# EAGLE design bluino_one_2.0 (EAGLE 7.6.0)
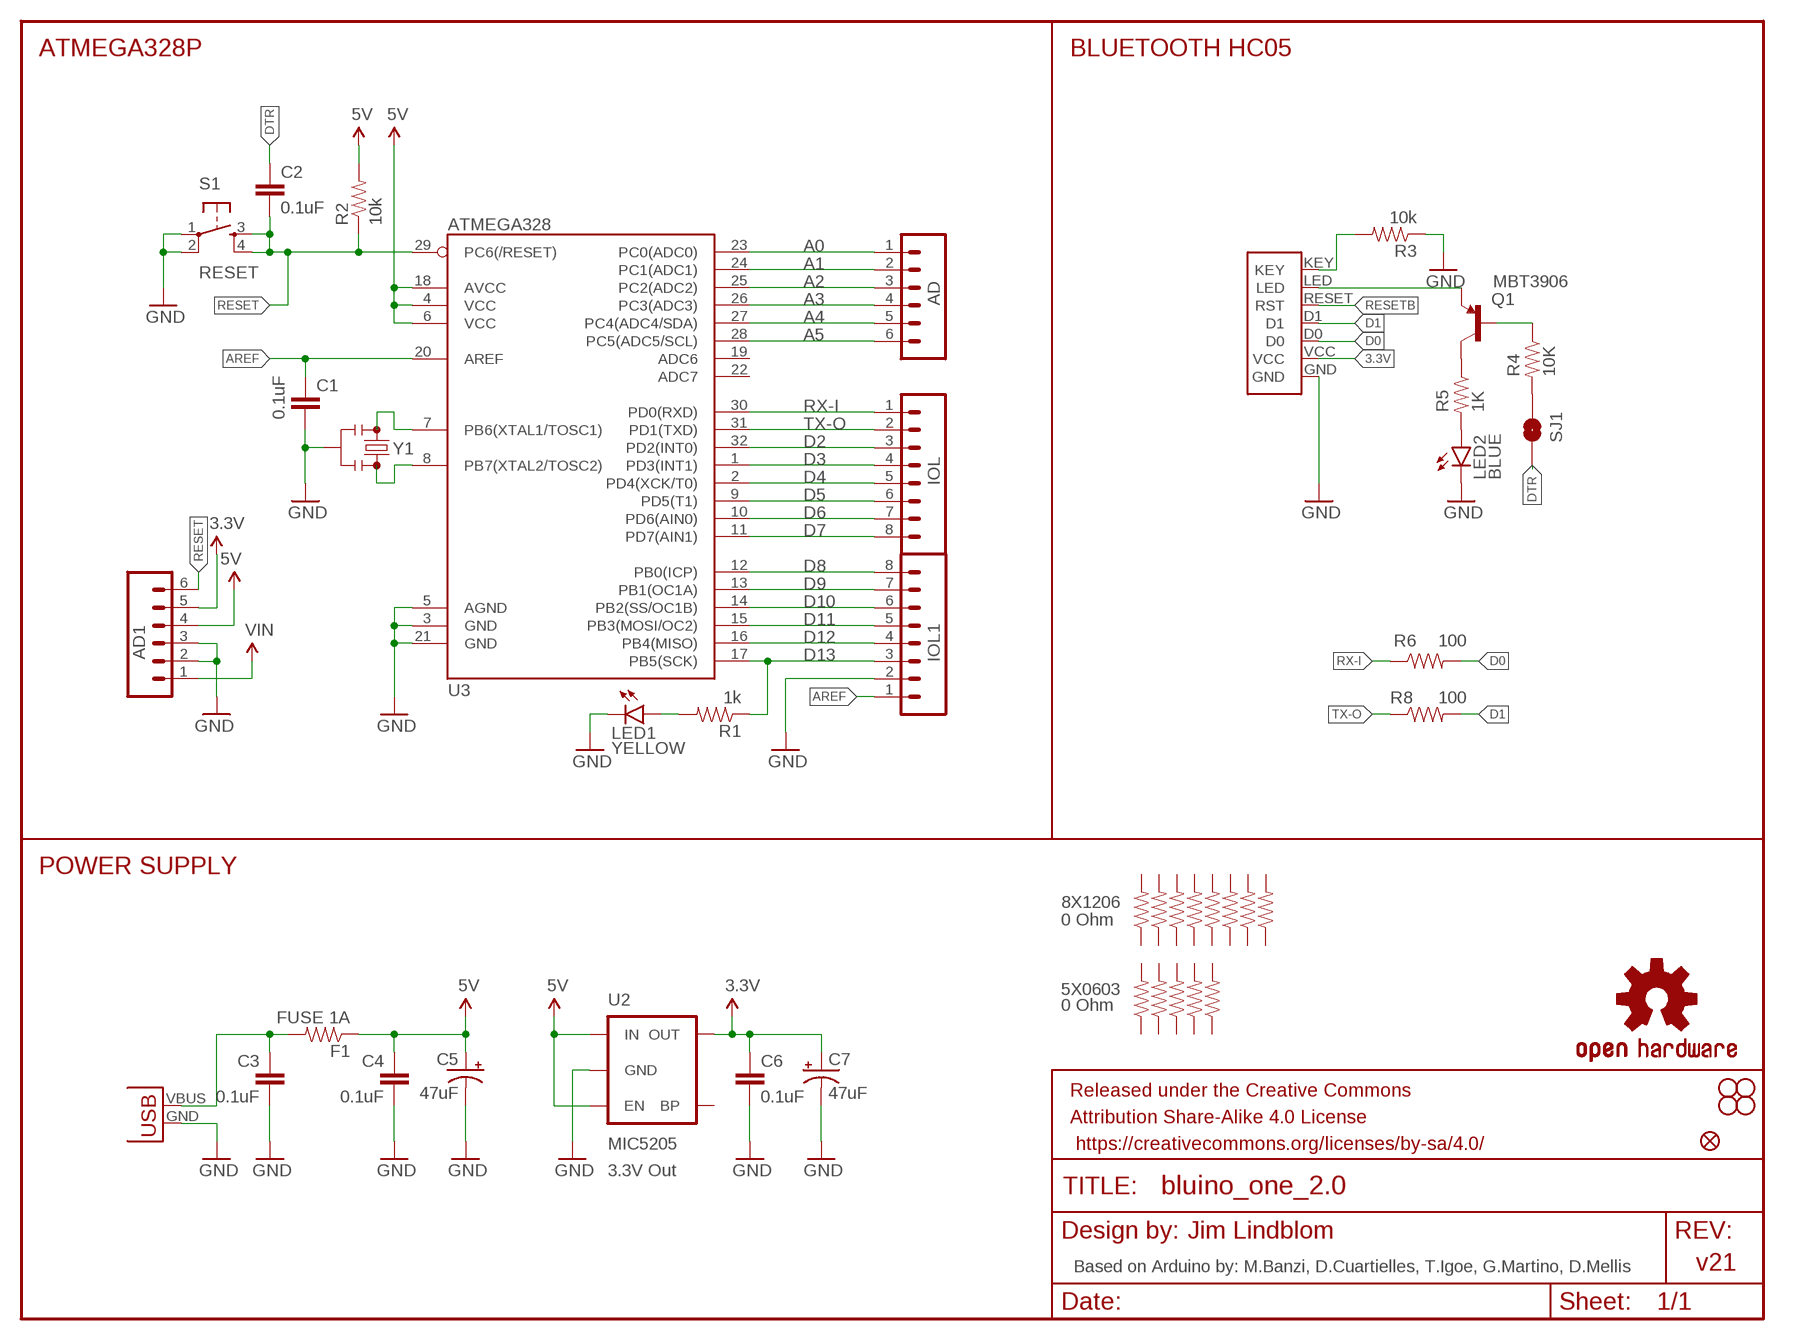
[diagram p0: schematic, sheet 1]

## Parts
5X0603  0 Ohm  RESISTOR0603-JUMP  [0603-RES-JUMP]
8X1206  0 Ohm  RESISTOR1206-JUMP  [1206-JUMP]
AD  M06SMD-STRAIGHT-COMBO  [1X06_SMD_STRAIGHT_COMBO]
AD1  M06SMD-STRAIGHT-COMBO  [1X06_SMD_STRAIGHT_COMBO]
C1  0.1uF  CAP0603-CAP  [0603-CAP]
C2  0.1uF  CAP0603-CAP  [0603-CAP]
C3  0.1uF  CAP0603-CAP  [0603-CAP]
C4  0.1uF  CAP0603-CAP  [0603-CAP]
C5  47uF  CAP_POL1206  [EIA3216]
C6  0.1uF  CAP0603-CAP-JUMP  [0603-CAP-JUMP]
C7  47uF  CAP_POL1206  [EIA3216]
F1  FUSE 1A  RESISTOR1206-JUMP  [1206-JUMP]
FID1  FIDUCIAL1.5X3  [FIDUCIAL-1.5X3]
FRAME2  FRAME-LETTER  [CREATIVE_COMMONS]
IOL  M08SMD-COMBO  [1X08_SMD_COMBINED]
IOL1  M08SMD-COMBO  [1X08_SMD_COMBINED]
JP3  STAND-OFF  [STAND-OFF]
JP4  STAND-OFF  [STAND-OFF]
JP5  STAND-OFF  [STAND-OFF]
JP6  STAND-OFF  [STAND-OFF]
LED1  YELLOW  LED0603  [LED-0603]
LED2  BLUE  LED0603  [LED-0603]
Q1  MBT3906  TRANSISTOR_PNPPMBT3906  [SOT23-3]
R1  1k  RESISTOR0603-RES  [0603-RES]
R2  10k  RESISTOR0603-RES  [0603-RES]
R3  10k  RESISTOR0603-JUMP  [0603-RES-JUMP]
R4  10K  RESISTOR0603-RES  [0603-RES]
R5  1K  RESISTOR0603-RES  [0603-RES]
R6  100  RESISTOR0603-RES  [0603-RES]
R8  100  RESISTOR0603-JUMP  [0603-RES-JUMP]
R10  10k  RESISTOR1206-JUMP  [1206-JUMP]
R11  10k  RESISTOR1206-JUMP  [1206-JUMP]
R12  10k  RESISTOR1206-JUMP  [1206-JUMP]
R15  10k  RESISTOR0603-JUMP  [0603-RES-JUMP]
R17  10k  RESISTOR0603-JUMP  [0603-RES-JUMP]
R18  10k  RESISTOR0603-JUMP  [0603-RES-JUMP]
R19  10k  RESISTOR0603-JUMP  [0603-RES-JUMP]
R41  0  RESISTOR1206-JUMP  [1206-JUMP]
R51  10k  RESISTOR1206-JUMP  [1206-JUMP]
R61  10k  RESISTOR1206-JUMP  [1206-JUMP]
R71  10k  RESISTOR1206-JUMP  [1206-JUMP]
S1  RESET  TAC_SWITCHSMD  [TACTILE_SWITCH_SMD]
SJ1  SPARKFUN22_SOLDERJUMPERNC  [SPARKFUN22_SJ_2S]
U2  MIC5205  V_REG_LDOSMD  [SOT23-5]
U3  ATMEGA328  ATMEGA168  [TQFP32-08]
U$9  HC05_KEY  [BLUINO_ONE_HC05]
U$16  OSHW-LOGOS  [OSHW-LOGO-S]
X1  USB-MICROB  USB  [USB_SOCKET]
Y1  8MHZ  RESONATOR8MHZ  [RESONATOR-SMD]

## Nets
3.3V: AD1.5 C6.1 C7.A(+) U2.5(OUT) U$9.VCC
5V: AD1.4 C4.1 C5.A(+) F1.1 R2.2 U2.1(IN) U2.3(EN) U3.4(VCC) U3.6(VCC) U3.18(AVCC)
A0: AD.1 U3.23(PC0(ADC0))
A1: AD.2 U3.24(PC1(ADC1))
A2: AD.3 U3.25(PC2(ADC2))
A3: AD.4 U3.26(PC3(ADC3))
A4: AD.5 U3.27(PC4(ADC4/SDA))
A5: AD.6 U3.28(PC5(ADC5/SCL))
AREF: C1.1 IOL1.1 U3.20(AREF)
D0: R6.2 U$9.D0
D1: R8.2 U$9.D1
D2: IOL.3 U3.32(PD2(INT0))
D3: IOL.4 U3.1(PD3(INT1))
D4: IOL.5 U3.2(PD4(XCK/T0))
D5: IOL.6 U3.9(PD5(T1))
D6: IOL.7 U3.10(PD6(AIN0))
D7: IOL.8 U3.11(PD7(AIN1))
D8: IOL1.8 U3.12(PB0(ICP))
D9: IOL1.7 U3.13(PB1(OC1A))
D10: IOL1.6 U3.14(PB2(SS/OC1B))
D11: IOL1.5 U3.15(PB3(MOSI/OC2))
D12: IOL1.4 U3.16(PB4(MISO))
D13: IOL1.3 R1.1 U3.17(PB5(SCK))
DTR: C2.1 SJ1.2
GND: AD1.2 AD1.3 C1.2 C3.2 C4.2 C5.C(-) C6.2 C7.C(-) IOL1.2 LED1.C LED2.C R3.1 S1.1 S1.2 U2.2(GND) U3.3(GND) U3.5(AGND) U3.21(GND) U$9.GND X1.GND Y1.2
LED: Q1.2(E) U$9.LED
N$1: LED1.A R1.2
N$2: R3.2 U$9.KEY
N$3: U3.7(PB6(XTAL1/TOSC1)) Y1.1
N$4: U3.8(PB7(XTAL2/TOSC2)) Y1.3
N$5: Q1.3(C) R5.1
N$9: LED2.A R5.2
N$23: Q1.1(B) R4.1
RESET: AD1.6 C2.2 R2.1 S1.3 S1.4 U3.29(PC6(/RESET))
RESETB: R4.2 SJ1.1 U$9.RESET(RST)
RX-I: IOL.1 R6.1 U3.30(PD0(RXD))
TX-O: IOL.2 R8.1 U3.31(PD1(TXD))
VIN: AD1.1
VUSB: C3.1 F1.2 X1.VBUS
Unconnected: 5X0603.1 5X0603.2 8X1206.1 8X1206.2 R10.1 R10.2 R11.1 R11.2 R12.1 R12.2 R15.1 R15.2 R17.1 R17.2 R18.1 R18.2 R19.1 R19.2 R41.1 R41.2 R51.1 R51.2 R61.1 R61.2 R71.1 R71.2 U2.4(BP) U3.19(ADC6) U3.22(ADC7)

## Notes on the sheet
- ATMEGA328P | BLUETOOTH HC05
- POWER SUPPLY
- 3.3V Out
- Jim Lindblom
- Based on Arduino by: M.Banzi, D.Cuartielles, T.Igoe, G.Martino, D.Mellis | v21

## Library data of the parts
5X0603 8X1206 F1 R3-R5 R8 R10-R12 R15 R17-R19 R41 R51 R61 R71 = SparkFun-Resistors:RESISTOR: Resistor Basic schematic elements and footprints for 0603, 1206, and PTH resistors.
AD AD1 = SparkFun:M06: Header 6 Standard 6-pin 0.1" header. Use with straight break away headers (SKU : PRT-00116), right angle break away headers (PRT-00553), swiss pins (PRT-00743), machine pins (PRT-00117), and female headers (PRT-00115). Molex polarized connector foot print use with SKU : PRT-08094 with associated crimp pins and housings. NOTES ON THE VARIANTS LOCK and LOCK_LONGPADS... This footprint was designed to help hold the alignment of a through-hole component (i.e. 6-pin header) while soldering it into place. You may notice that each hole has been shifted either up or down by 0.005 of an inch from it's more standard position (which is a perfectly straight line). This slight alteration caused the pins (the squares in the middle) to touch the edges of the holes. Because they are alternating, it causes a "brace" to hold the component in place. 0.005 has proven to be the perfect amount of "off-center" position when using our standard breakaway headers. Although looks a little odd when you look at the bare footprint, once you have a header in there, the alteration is very hard to notice. Also, if you push a header all the way into place, it is covered up entirely on the bottom side. This idea of altering the position of holes to aid alignment will be further integrated into the Sparkfun Library for other footprints. It can help hold any component with 3 or more connection pins.
C1-C4 = SparkFun:CAP: Capacitor Standard 0603 ceramic capacitor, and 0.1" leaded capacitor.
C5 = SparkFun-Capacitors:CAP_POL: Capacitor Polarized These are standard SMD and PTH capacitors. Normally 10uF, 47uF, and 100uF in electrolytic and tantalum varieties. Always verify the external diameter of the through hole cap, it varies with capacity, voltage, and manufacturer. The EIA devices should be standard.
C6 = SparkFun-Capacitors:CAP: Capacitor Standard 0603 ceramic capacitor, and 0.1" leaded capacitor.
C7 = SparkFun:CAP_POL: Capacitor Polarized These are standard SMD and PTH capacitors. Normally 10uF, 47uF, and 100uF in electrolytic and tantalum varieties. Always verify the external diameter of the through hole cap, it varies with capacity, voltage, and manufacturer. The EIA devices should be standard.
FID1 = SparkFun-Retired:FIDUCIAL: Fiducial Alignment Points Various fiducial points for machine vision alignment.
FRAME2 = SparkFun-Aesthetics:FRAME-LETTER: Schematic Frame Standard 8.5x11 US Letter frame; DESIGNER: NAME; VERSION: v01
IOL IOL1 = SparkFun:M08: Header 8 Standard 8-pin 0.1" header. Use with straight break away headers (SKU : PRT-00116), right angle break away headers (PRT-00553), swiss pins (PRT-00743), machine pins (PRT-00117), and female headers (PRT-00115).
JP3-JP6 = SparkFun:STAND-OFF: Stand Off This is the mechanical footprint for a #4 phillips button head screw. Use the keepout ring to avoid running the screw head into surrounding components. SKU : PRT-00447
LED1 LED2 = SparkFun-LED:LED: LEDs Standard schematic elements and footprints for 5mm, 3mm, 1206, and 0603 sized LEDs. 5mm - Spark Fun Electronics SKU : COM-00529 (and others)
Q1 = SparkFun-DiscreteSemi:TRANSISTOR_PNP: Generic PNP BJT Double check pinouts against datasheets- not all devices are the same! MMBT3906 - 40V 200mA SOT-23 (TRANS-08052) MMBT4403 - 40V 600mA SOT-23 (TRANS-09245); PROD_ID: TRANS-08052; VALUE: PMBT3906
R1 R2 R6 = SparkFun:RESISTOR: Resistor Basic schematic elements and footprints for 0603, 1206, and PTH resistors.
S1 = SparkFun:TAC_SWITCH: Momentary Switch Button commonly used for reset or general input. Spark Fun Electronics SKU : COM-00097
SJ1 = bluino:SPARKFUN22_SOLDERJUMPER: Solder Jumper Standard SMD solder jumper. Used to automate production. Two varients : Normally Open and Normally Closed are the same, but have different paste layers. NC will have a large amount of paste and should jumper during reflow.
U2 = SparkFun:V_REG_LDO: Voltage Regulator LDO Standard 150mA LDO voltage regulator in SOT-23 layout. Micrel part MIC5205. BP (by-pass) pin is used to lower output noise with 470pF cap.
U3 = SparkFun:ATMEGA168
U$9 = Bluino-Component:HC05_KEY
U$16 = SparkFun-Aesthetics:OSHW-LOGO: Open Source Hardware Logo This logo indicates the piece of hardware it is found on incorporates a OSHW license and/or adheres to the definition of open source hardware found here: http://freedomdefined.org/OSHW
X1 = Bluino-Component:USB
Y1 = SparkFun-FreqCtrl:RESONATOR: Resonator Small SMD resonator. Used, eg, on the Arduino Pro/ Pro Mini boards. 8MHz- XTAL-08895 16MHz- XTAL-08900; PROD_ID: XTAL-08895

## Board
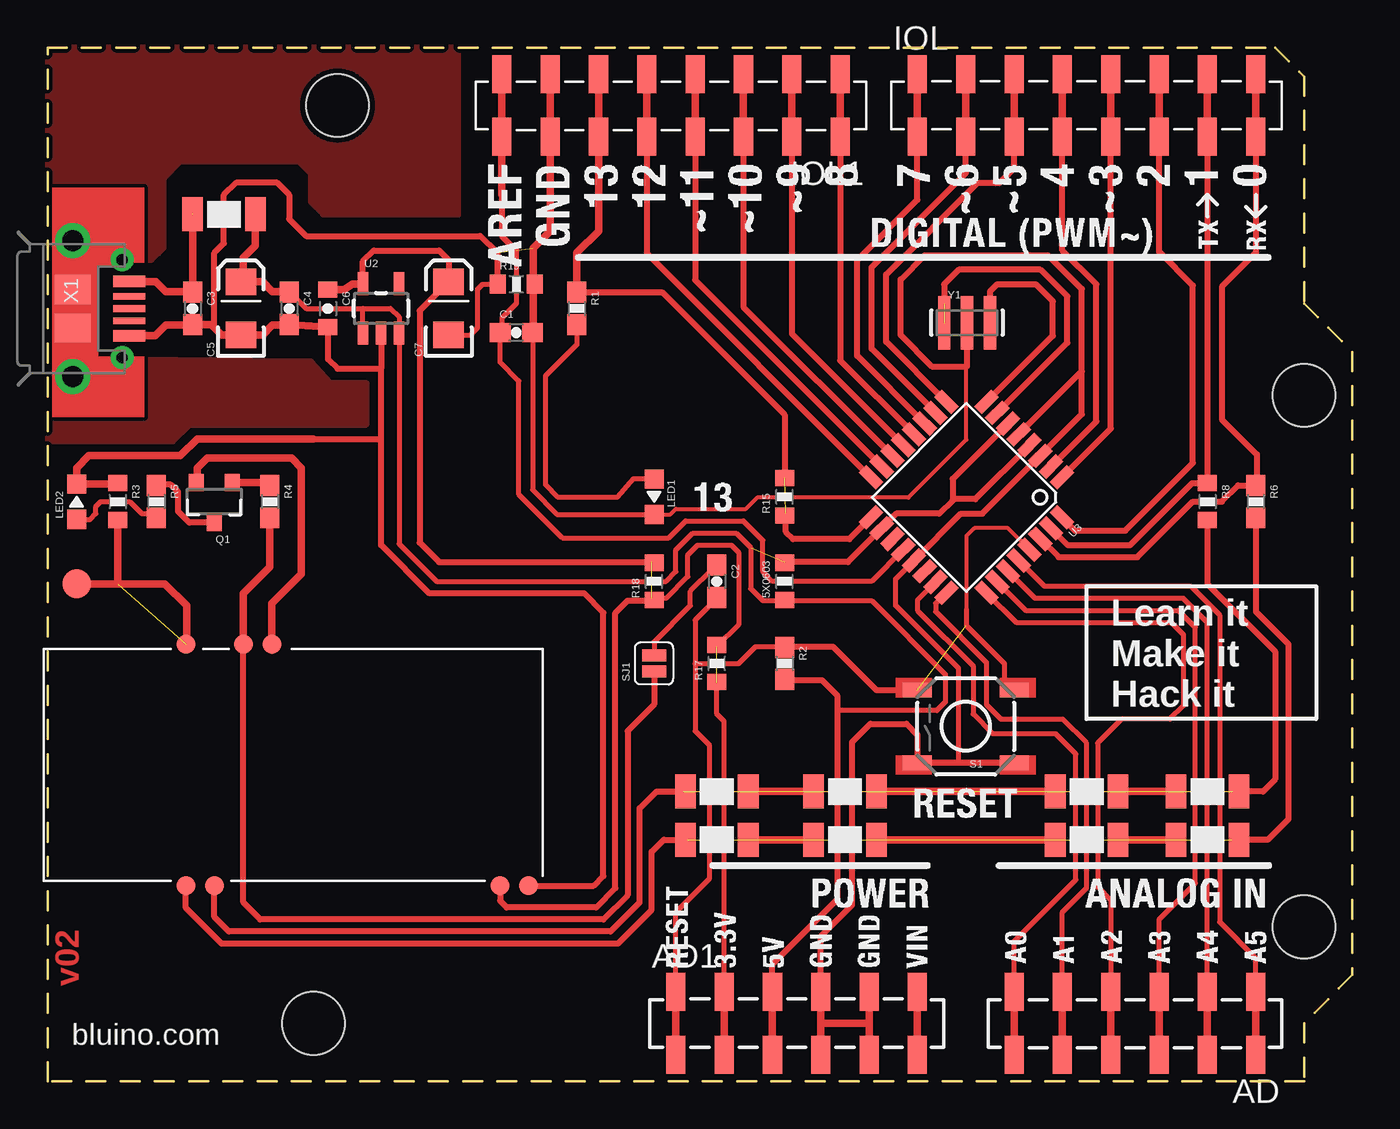
[diagram p1: board, top side]
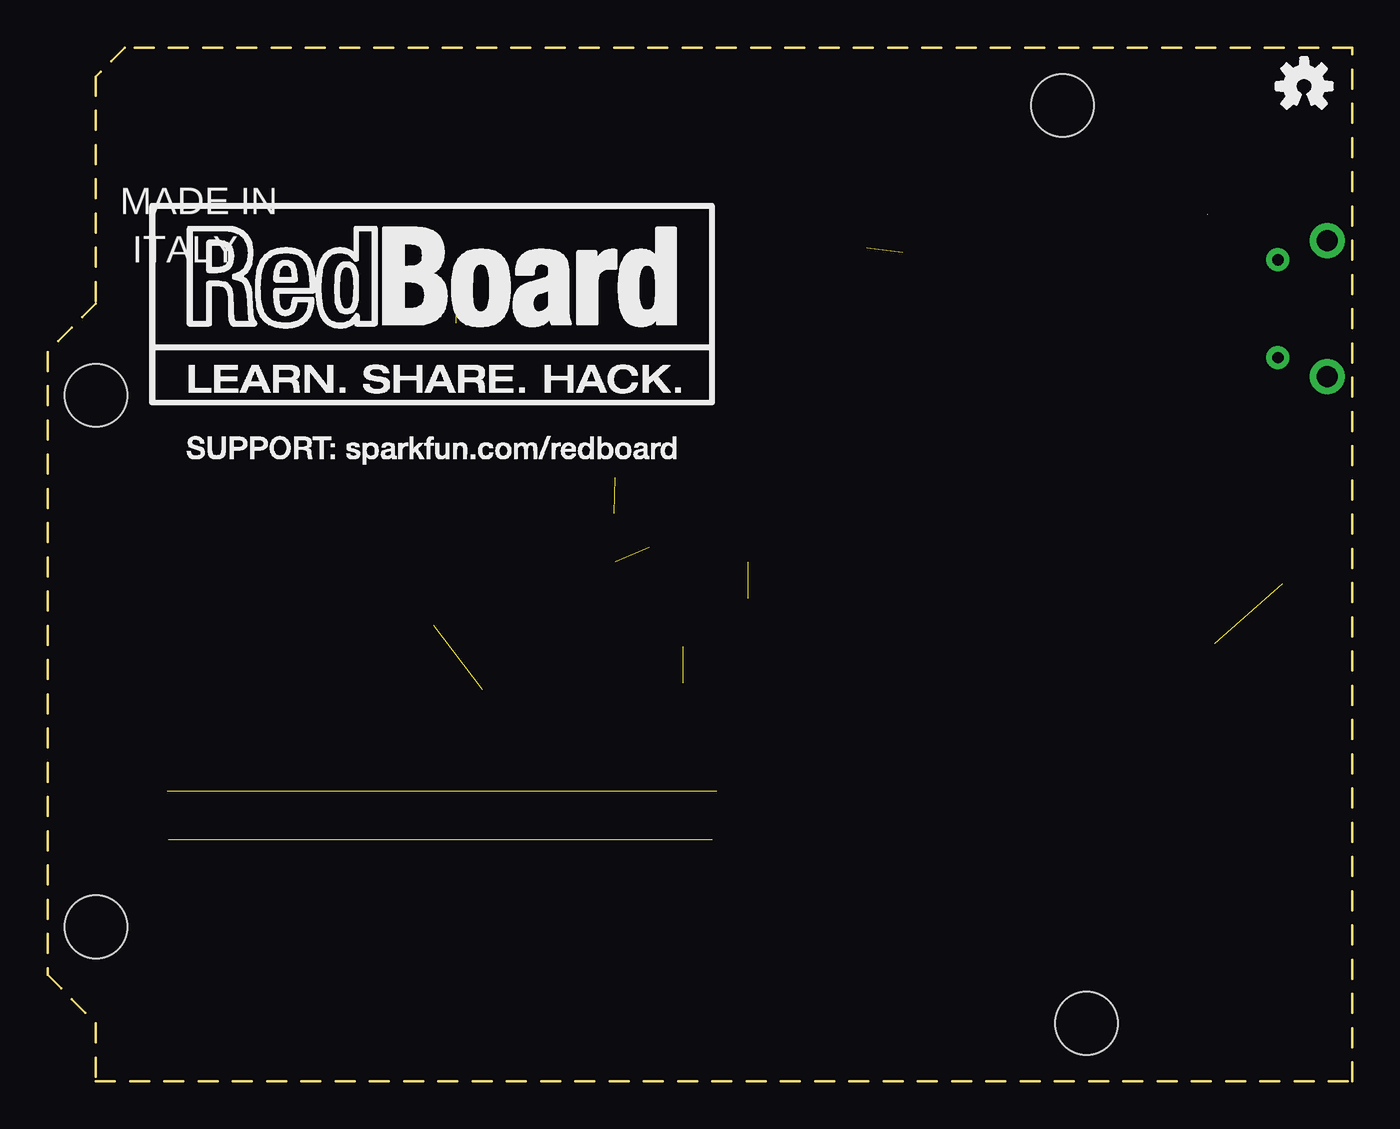
[diagram p2: board, bottom side, seen from below]

Size 68.58 x 54.36 mm. Coordinates in mm from the lower left corner, seen from the top.
Outline: 0,54.36 64.52,54.36 66.04,52.83 66.04,40.89 68.58,38.35 68.58,5.59 66.04,3.05 66.04,0 0,0 0,54.36
Copper layers (1*16): Top 0.035mm / dielectric 1.5mm / Bottom 0.035mm
Design rules "SparkFun-2-layer": minimum track width 7mil, minimum drill 15mil, track to track 8mil, track to pad 8mil, pad to pad 8mil, via to via 8mil, smd to smd 8mil, copper to edge 8mil, drill to drill 8mil, minimum pad ring 12mil, minimum via ring 10mil, stop-mask expansion 4mil, vias tented up to drill 20mil, thermal gap 10mil
vRestrict: area 0.6,22.4 to 2,30.6; area 5.7,23.1 to 7.4,30.6; area 47.9,10.8 to 48.5,11.3; area 50.4,10.7 to 50.9,11.6; area 11.3,29.3 to 12.7,31.6; area 0.3,13 to 9.4,25

### Footprints (pad centres in the part's own frame; a part is rotated, then mirrored left to right if it is on the bottom)
0603-RES-JUMP = smd 0.846 x 1: 1 -0.977,0; 2 0.977,0
1206-JUMP = smd 1.092 x 1.8: 1 -1.654,0; 2 1.654,0
1X06_SMD_STRAIGHT_COMBO = smd 1 x 2: 1 0,1.65; 1-2 0,-1.65; 2 -2.54,-1.65; 2-2 -2.54,1.65; 3 -5.08,1.65; 3-2 -5.08,-1.65; 4 -7.62,-1.65; 4-2 -7.62,1.65; 5 -10.16,1.65; 5-2 -10.16,-1.65; 6 -12.7,-1.65; 6-2 -12.7,1.65
0603-CAP = smd 1.1 x 1: 1 -0.85,0; 2 0.85,0
EIA3216 = smd 1.4 x 1.6: A 1.4,0; C -1.4,0
0603-CAP-JUMP = smd 0.846 x 1: 1 -0.977,0; 2 0.977,0
FIDUCIAL-1.5X3 = smd 1.5 x 1.5: 1 0,0
1X08_SMD_COMBINED = smd 1 x 2: 1 0,-1.65; 1@2 0,1.65; 2 -2.54,1.65; 2@2 -2.54,-1.65; 3 -5.08,-1.65; 3@2 -5.08,1.65; 4 -7.62,1.65; 4@2 -7.62,-1.65; 5 -10.16,-1.65; 5@2 -10.16,1.65; 6 -12.7,1.65; 6@2 -12.7,-1.65; 7 -15.24,-1.65; 7@2 -15.24,1.65; 8 -17.78,1.65; 8@2 -17.78,-1.65
STAND-OFF = hole 3.302: 0,0
LED-0603 = smd 1 x 1: A 0,-0.928; C 0,0.928
SOT23-3 = smd 0.8 x 0.9: 1 -0.95,-1; 2 0.95,-1; 3 0,1.1
0603-RES = smd 1.1 x 1: 1 -0.85,0; 2 0.85,0
TACTILE_SWITCH_SMD = smd 1.524 x 0.762: 1 -2.54,1.905; 2 2.54,1.905; 3 -2.54,-1.905; 4 2.54,-1.905
SPARKFUN22_SJ_2S = smd 0.635 x 1.27: 1 -0.412,0; 2 0.412,0
SOT23-5 = smd 0.55 x 1.2: 1 -0.95,-1.3; 2 0,-1.3; 3 0.95,-1.3; 4 0.95,1.3; 5 -0.95,1.3
TQFP32-08 = smd 1.27 x 0.559: 1 -4.293,2.8; 2 -4.293,2; 3 -4.293,1.2; 4 -4.293,0.4; 5 -4.293,-0.4; 6 -4.293,-1.2; 7 -4.293,-2; 8 -4.293,-2.8; 17 4.293,-2.8; 18 4.293,-2; 19 4.293,-1.2; 20 4.293,-0.4; 21 4.293,0.4; 22 4.293,1.2; 23 4.293,2; 24 4.293,2.8 | smd 0.559 x 1.27: 9 -2.8,-4.293; 10 -2,-4.293; 11 -1.2,-4.293; 12 -0.4,-4.293; 13 0.4,-4.293; 14 1.2,-4.293; 15 2,-4.293; 16 2.8,-4.293; 25 2.8,4.293; 26 2,4.293; 27 1.2,4.293; 28 0.4,4.293; 29 -0.4,4.293; 30 -1.2,4.293; 31 -2,4.293; 32 -2.8,4.293
BLUINO_ONE_HC05 = smd 1 x 1: D0 -19.526,0; D1 -18.018,0; GND -1.508,0; KEY -19.522,12.7; LED -15.002,12.684; RESET -16.51,12.684; VCC -3.016,0
USB_SOCKET = smd 0.35 x 1.7: D+ 0.013,3.023; D- -0.637,3.023; ID 0.663,3.023 | smd 0.604 x 1.7: GND 1.44,3.023; VBUS -1.414,3.023 | drill 1.1 pad 1.854: MT1 -3.562,0.048; MT2 3.588,0.048 | drill 0.6 pad 0.94: MT3 -2.562,2.648; MT4 2.588,2.648 | smd 1.5 x 1.9: P$1 -0.987,0.048; P$2 1.013,0.058
RESONATOR-SMD = smd 0.45 x 1.905: 1 -1.2,0; 2 0,0; 3 1.2,0 | smd 0.635 x 2.794: P$1 -1.206,0; P$2 0,0; P$3 1.206,0

### Placement (x,y rotation side)
5X0603  38.73,26.29 90 top
8X1206  35.18,15.24 0 top
AD  50.8,3.05 180 top
AD1  45.72,3.05 0 top
C1  24.64,39.37 0 top
C2  35.18,26.29 270 top
C3  7.62,40.64 270 top
C4  12.7,40.64 270 top
C5  10.16,40.64 90 top
C6  14.73,40.64 270 top
C7  21.08,40.64 90 top
F1  9.27,45.59 180 top
FID1  1.52,26.16 0 top
FRAME2  0,0 0 top
IOL  63.5,51.31 0 top
IOL1  23.88,51.31 180 top
JP3  13.97,3.05 0 top
JP4  66.04,8.13 0 top
JP5  66.04,36.07 0 top
JP6  15.24,51.31 0 top
LED1  31.88,30.73 180 top
LED2  1.52,30.48 0 top
Q1  8.76,30.48 180 top
R1  27.81,40.64 270 top
R2  38.73,21.97 270 top
R3  3.68,30.48 270 top
R4  11.68,30.48 270 top
R5  5.71,30.48 270 top
R6  63.5,30.48 270 top
R8  60.96,30.48 270 top
R10  60.96,12.7 0 top
R11  54.61,15.24 0 top
R12  54.61,12.7 0 top
R15  38.73,30.73 90 top
R17  35.18,21.97 90 top
R18  31.88,26.29 90 top
R19  24.64,41.91 0 top
R41  41.91,15.24 0 top
R51  41.91,12.7 0 top
R61  35.18,12.7 0 top
R71  60.96,15.24 0 top
S1  48.26,18.67 180 top
SJ1  31.88,21.97 90 top
U2  17.53,40.64 0 top
U3  48.29,30.7 225 top
U$9  26.8,10.29 0 top
U$16  2.54,52.32 0 bottom
X1  1.27,40.64 270 top
Y1  48.32,39.88 0 top

### Tracks (layer width: path | path; a pad name or v marks a point on that pad's centre or on a via)
3.3V  (2 unrouted)
  Top 0.254: AD1.5 35.56,18.92 35.18,19.3 35.18,20.95 | 31.75,25.4 32.51,25.4 33.66,26.54 33.66,27.69 34.16,28.19 35.94,28.19 36.32,27.81 36.32,24 35.18,22.86
  Top 0.305: U$9.VCC 23.78,9.49 24.13,9.14 28.83,9.14 29.84,10.16 29.84,24.64 30.48,25.27 31.62,25.27 31.75,25.4 | 31.75,27.3 20.57,27.3 19.56,28.32 19.56,40.52 C7.A 21.08,43.18 20.57,43.69 17.14,43.69 16.58,43.12 U2.5
  Top 0.406: C6.1 15.58,41.62 16,41.91 16.55,41.91 U2.5
5V  (1 unrouted)
  Top 0.254: 41.53,19.49 46.74,19.49 47.18,19.94 47.18,21.4 43.31,25.27 37.59,25.27 36.96,25.91 36.96,28.07 36.2,28.83 33.91,28.83 33.02,27.94 33.02,26.8 32.51,26.29 20.45,26.29 18.48,28.26 U2.3 18.48,40.2 18.03,40.64 16.58,40.64 | C4.1 12.74,41.49 13.59,40.64 16.58,40.64 | U2.1 16.58,40.64
  Top 0.305: U3.4 48.76,30.61 47.62,30.61 47.56,30.54 | 47.56,30.54 46.86,29.84 44.6,29.84 U3.18 42.06,27.3 38.73,27.3 | U3.6 47.56,31.67 47.56,30.54 | AD1.4 38.1,6.16 41.53,9.59 41.53,19.49 41.53,20.26 40.7,21.08 38.77,21.08 R2.2
  Top 0.406: C4.1 12.66,41.53 11.81,41.53 11.3,42.04 C5.A 10.29,42.17 10.29,43.31 10.92,43.94 F1.1
123
  pour Top: 0,54.36 0,33.66 6.6,33.66 7.49,34.54 16.76,34.54 16.76,36.7 14.86,36.7 13.84,37.85 12.7,37.85 2.92,37.97 2.54,38.35 2.54,42.55 3.17,43.18 5.46,43.18 6.1,43.81 6.1,47.5 6.99,48.39 13.21,48.39 13.84,47.75 13.84,46.23 14.48,45.59 21.59,45.59 21.59,54.36
A0
  Top 0.254: U3.23 45.72,25.3 45.72,24.77 48.64,21.84 48.64,19.3 49.66,18.29 52.96,18.29 54.04,17.21 54.04,10.6 50.8,7.37 AD.1
A1
  Top 0.254: U3.24 46.67,25.12 46.67,24.7 49.34,22.04 49.34,19.81 50.1,19.05 53.34,19.05 54.61,17.78 54.61,10.16 53.34,8.89 AD.2
A2
  Top 0.254: U3.25 50.9,24.13 59.05,24.13 59.69,23.5 59.69,19.75 58.99,19.05 56.45,19.05 55.18,17.78 55.18,10.22 55.88,9.53 AD.3
A3
  Top 0.254: U3.26 51.4,24.77 59.44,24.77 60.33,23.88 60.33,10.41 58.42,8.51 AD.4
A4
  Top 0.254: AD.5 60.96,24.13 59.69,25.4 51.9,25.4 U3.27
A5
  Top 0.254: AD.6 63.5,6.48 61.59,8.38 61.59,24.51 60.07,26.04 52.39,26.04 U3.28
AREF
  Top 0.254: 24.64,43.69 24.64,40.89 23.88,40.13 23.88,39.46 C1.1 23.79,37.81 24.77,36.83 24.77,30.86 27.05,28.57 32.64,28.57 33.53,29.46 36.58,29.46 37.59,28.45 37.59,26.8 38.1,26.29 43.31,26.29 U3.20
  Top 0.305: 23.88,46.61 23.88,44.45 24.64,43.69
  Top 0.406: IOL1.1 23.88,46.61
D0  (1 unrouted)
  Top 0.305: R6.2 63.5,24.7 65.22,22.99 65.22,13.78 64.14,12.7 62.23,12.7 | 33.66,12.7 32.38,12.7 31.75,12.06 31.75,9.02 29.97,7.24 9.14,7.24 7.27,9.11 U$9.D0
D1  (1 unrouted)
  Top 0.305: R8.2 60.96,26.16 64.52,22.61 64.52,15.88 63.88,15.24 62.29,15.24 | 33.4,15.24 32,15.24 31.11,14.35 31.11,9.4 29.59,7.87 9.53,7.87 8.76,8.64 8.76,10.27 U$9.D1
D2
  Top 0.305: U3.32 54,28.96 56.64,28.96 60.2,32.51 60.2,41.85 58.42,43.62 IOL.3
D3
  Top 0.305: U3.1 55.88,34.33 IOL.4
D4
  Top 0.305: U3.2 55.12,34.7 55.12,41.91 53.34,43.69 IOL.5
D5
  Top 0.305: U3.9 44.07,38.88 44.07,42.42 48.9,47.24 50.04,47.24 50.8,48.01 IOL.6
D6
  Top 0.305: U3.10 43.31,38.52 43.31,42.8 48.26,47.75 IOL.7
D7
  Top 0.305: U3.11 42.55,38.15 42.55,43.18 45.72,46.35 IOL.8
D8
  Top 0.305: IOL1.8 41.66,37.9 U3.12
D9
  Top 0.305: IOL1.7 39.12,39.31 U3.13
D10
  Top 0.305: IOL1.6 36.58,40.72 U3.14
D11
  Top 0.305: IOL1.5 34.04,42.13 U3.15
D12
  Top 0.305: IOL1.4 31.5,43.54 U3.16
D13  (1 unrouted)
  Top 0.305: R1.1 32.3,41.49 38.73,35.05 38.73,31.75 | U3.17 42.14,28.51 39.18,28.51 38.8,28.89 38.8,29.84
  Top 0.406: IOL1.3 28.96,44.7 27.81,43.56 R1.1
DTR
  Top 0.254: C2.1 35.09,27.05 34.92,26.92 33.78,25.78 33.78,25.02 31.88,23.11 SJ1.2
GND  (1 unrouted)
  Top 0.203: 48.32,37.59 48.28,37.59 48.28,33.73 45.24,30.68 37.29,30.68 36.7,30.1 33.02,30.1 32.73,29.81 LED1.C
  Top 0.254: 40.77,1.4 40.64,1.27 40.64,3.05 AD1.3 | U3.21 44.58,26.42 44.58,25.02 47.88,21.72 47.88,16.76 | C1.2 25.49,31.09 26.77,29.81 LED1.C | C7.C 22.22,39.24 22.61,39.62 22.61,41.66 22.86,41.91 23.5,41.91
  Top 0.305: 8.6,39.79 8.76,39.7 8.76,43.56 9.27,44.07 9.27,46.61 9.91,47.24 12.06,47.24 12.7,46.61 12.7,45.34 13.59,44.45 22.73,44.45 23.62,43.56 23.62,42.04 23.5,41.91 | U3.21 48,29.84 49.13,29.84 U3.3 54.36,35.07 54.36,37.33 | 54.36,37.33 54.36,41.66 52.58,43.43 46.1,43.43 44.83,42.16 44.83,39.24 46.48,37.59 48.32,37.59 Y1.2 | U3.5 54.36,37.33 | AD1.3 40.64,7.62 42.29,9.27 42.29,17.84 43.24,18.8 45.15,18.8 45.72,18.22 S1.2 47.88,16.76 S1.1 | 17.53,33.78 17.53,28.19 20.07,25.65 28.19,25.65 29.21,24.64 29.21,10.79 28.7,10.29 U$9.GND | 17.53,33.78 17.53,37.47 | C6.2 14.73,37.97 15.24,37.47 17.53,37.47 | U2.2 17.53,37.47 | 13.97,33.78 17.53,33.78
  Top 0.406: X1.GND 5.67,39.2 6.22,39.75 7.58,39.75 C3.2 8.6,39.79 9.14,39.24 C5.C 11.3,39.24 11.81,39.75 12.66,39.75 C4.2 C6.2 | IOL1.2 26.42,44.7 25.53,43.81 25.53,39.41 C1.2 | AD1.2 43.18,3.05 40.64,3.05 | R3.1 3.63,31.41 LED2.C 1.52,32.26 2.16,32.89 6.99,32.89 7.87,33.78 13.97,33.78
LED
  Top 0.406: Q1.2 7.87,31.54 7.87,32.26 8.38,32.77 12.83,32.77 13.34,32.26 13.34,26.67 11.79,25.13 U$9.LED
N$1
  Top 0.254: R1.2 27.81,38.73 26.16,37.08 26.16,31.37 26.8,30.73 29.97,30.73 30.8,31.69 31.99,31.69
  Top 0.305: 31.99,31.69 LED1.A
N$2  (1 unrouted)
  Top 0.406: R3.2 3.68,26.16
N$3  (1 unrouted)
  Top 0.305: U3.7 53.59,38.84 53.59,41.27 52.2,42.67 47.88,42.67 47.12,41.91 47.12,40.9 47.12,40.89
N$4
  Top 0.305: U3.8 52.83,39.2 52.83,41.02 51.94,41.91 49.91,41.91 49.53,41.53 Y1.3
N$5
  Top 0.305: Q1.3 7.45,29.38 6.86,29.97 6.86,30.99 6.48,31.37 5.75,31.37 R5.1
N$6
  Top 0.406: 7.3,22.99 7.3,25.02 6.16,26.16 1.14,26.16
N$7
  Top 0.406: 36.83,12.7 40.26,12.7
N$8
  Top 0.406: 36.83,15.24 40.01,15.24
N$9
  Top 0.254: R5.2 5.5,29.84 4.95,29.84 4.32,30.48 2.79,30.48 2.54,30.23 2.54,29.84 2.25,29.55 LED2.A
  Top 0.406: 5.62,29.73 R5.2
N$10
  Top 0.406: 43.81,15.24 52.96,15.24
N$11
  Top 0.406: 43.81,12.7 53.09,12.7
N$12
  Top 0.406: 56.39,15.24 59.44,15.24
N$13
  Top 0.406: 56.39,12.7 59.31,12.7
N$15  (via drill 0.27 pad 0.25)
  other vias: 15.24,51.31
N$16  (via drill 0.27 pad 0.25)
  other vias: 13.97,3.05
N$17  (via drill 0.27 pad 0.25)
  other vias: 66.04,8.13
N$18  (via drill 0.27 pad 0.25)
  other vias: 66.04,36.07
N$23
  Top 0.406: Q1.1 11.53,31.48 R4.1
RESET  (1 unrouted)
  Top 0.203: U3.29 50.48,29.08 48.7,29.08 48.28,28.66 48.28,24.79
  Top 0.254: AD1.6 33.02,8.89 34.8,10.67 34.8,17.65 34.04,18.41 34.04,21.97 | C2.2 35.18,25.4 34.04,24.26 34.04,21.97 | 34.04,21.97 36.32,21.97 37.21,22.86 38.7,22.86 R2.1 | S1.3 50.29,21.08 50.29,21.97 48.28,23.98 48.28,24.79
  Top 0.305: R2.1 38.77,22.86 41.27,22.86 43.56,20.57 S1.4
RESETB
  Top 0.305: SJ1.1 31.88,19.81 30.48,18.41 30.48,9.78 29.21,8.51 11.18,8.51 10.29,9.4 U$9.RESET
  Top 0.406: U$9.RESET 10.29,25.65 11.68,27.05 R4.2
RX-I
  Top 0.305: U3.30 53.13,27.56 57.28,27.56 60.2,30.48 61.72,30.48 62.57,31.33 R6.1 63.56,31.39 63.56,32.96 61.72,34.8 61.72,41.78 63.5,43.56 IOL.1
TX-O
  Top 0.305: U3.31 53.63,28.19 56.9,28.19 60.16,31.46 R8.1 IOL.2
VUSB  (1 unrouted)
  Top 0.406: X1.VBUS 5.7,42.05 6.22,41.53 7.58,41.53 C3.1 F1.2
(copper drawn outside any net)
  shapes: Top area x17

### Text on the board
Top: v02
tPlace: Learn it / Make it / Hack it | bluino.com
bNames: MADE IN | ITALY
tDocu: J.Lindblom
214bmp: D:/SmartProjects/Snc/a4_bn_logo2.bmp